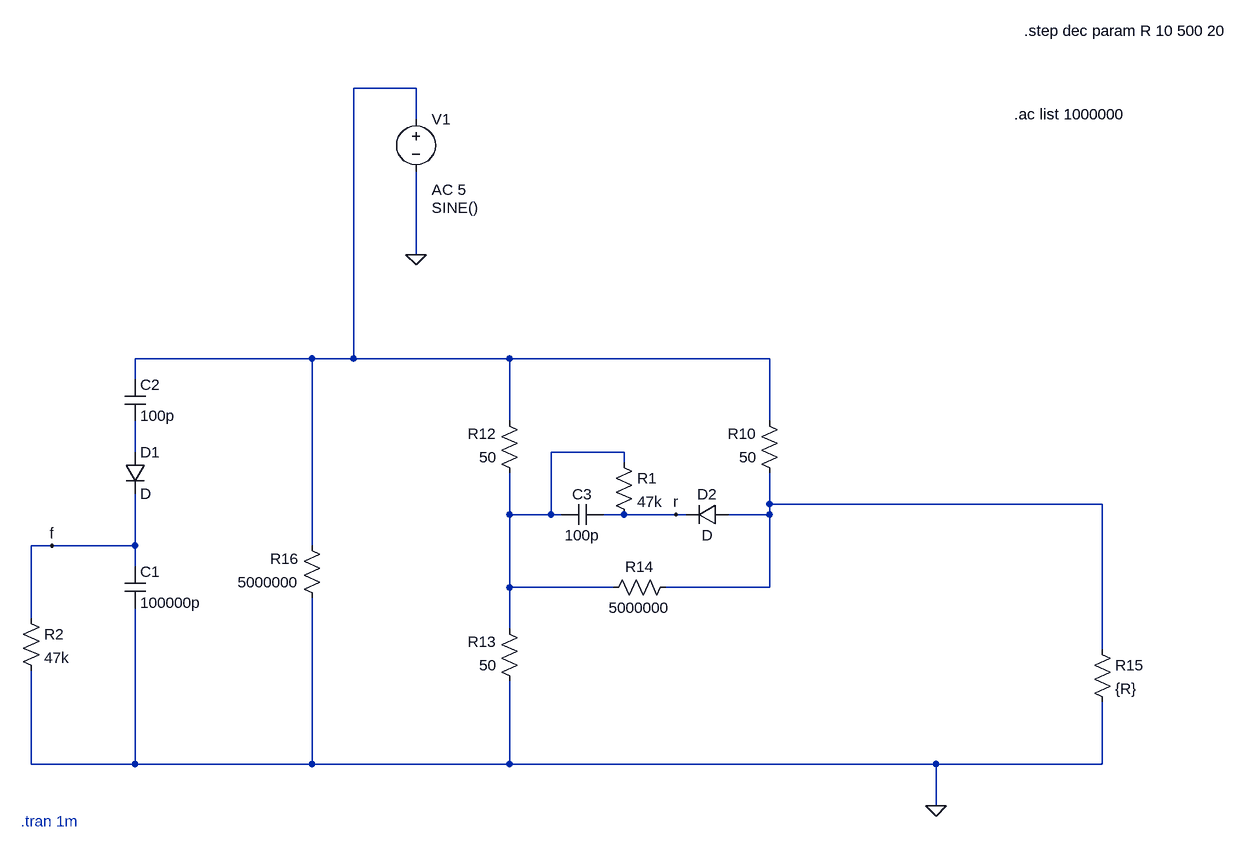
[diagram p0: schematic Mod Gamma Model.asc]
Mod Gamma Model.asc, the LTspice schematic file:
Version 4
SHEET 1 1080 1208
WIRE -192 64 -288 64
WIRE -192 112 -192 64
WIRE -192 320 -192 192
WIRE -352 480 -624 480
WIRE -288 480 -288 64
WIRE -288 480 -352 480
WIRE -48 480 -288 480
WIRE 352 480 -48 480
WIRE -624 512 -624 480
WIRE -48 576 -48 480
WIRE 352 576 352 480
WIRE -624 624 -624 576
WIRE 128 624 16 624
WIRE 128 640 128 624
WIRE 352 704 352 656
WIRE 864 704 352 704
WIRE -48 720 -48 656
WIRE 16 720 16 624
WIRE 16 720 -48 720
WIRE 32 720 16 720
WIRE 128 720 96 720
WIRE 208 720 128 720
WIRE 224 720 208 720
WIRE 352 720 352 704
WIRE 352 720 288 720
WIRE -752 768 -784 768
WIRE -624 768 -624 688
WIRE -624 768 -752 768
WIRE -352 768 -352 480
WIRE -624 800 -624 768
WIRE -48 832 -48 720
WIRE 112 832 -48 832
WIRE 352 832 352 720
WIRE 352 832 192 832
WIRE -784 880 -784 768
WIRE -48 896 -48 832
WIRE 864 928 864 704
WIRE -784 1104 -784 960
WIRE -624 1104 -624 864
WIRE -624 1104 -784 1104
WIRE -352 1104 -352 848
WIRE -352 1104 -624 1104
WIRE -48 1104 -48 976
WIRE -48 1104 -352 1104
WIRE 608 1104 -48 1104
WIRE 864 1104 864 1008
WIRE 864 1104 608 1104
WIRE 608 1168 608 1104
FLAG 608 1168 0
FLAG -192 320 0
FLAG -752 768 f
FLAG 208 720 r
SYMBOL voltage -192 96 R0
WINDOW 123 24 124 Left 2
WINDOW 39 0 0 Left 0
WINDOW 3 24 152 Left 2
SYMATTR Value2 AC 5
SYMATTR InstName V1
SYMATTR Value SINE()
SYMBOL res 368 672 R180
WINDOW 0 36 76 Left 2
WINDOW 3 36 40 Left 2
SYMATTR InstName R10
SYMATTR Value 50
SYMBOL res -32 672 R180
WINDOW 0 36 76 Left 2
WINDOW 3 36 40 Left 2
SYMATTR InstName R12
SYMATTR Value 50
SYMBOL res -32 992 R180
WINDOW 0 36 76 Left 2
WINDOW 3 36 40 Left 2
SYMATTR InstName R13
SYMATTR Value 50
SYMBOL res 208 816 R90
WINDOW 0 0 56 VBottom 2
WINDOW 3 32 56 VTop 2
SYMATTR InstName R14
SYMATTR Value 5000000
SYMBOL res 848 912 R0
SYMATTR InstName R15
SYMATTR Value {R}
SYMBOL res -336 864 R180
WINDOW 0 36 76 Left 2
WINDOW 3 36 40 Left 2
SYMATTR InstName R16
SYMATTR Value 5000000
SYMBOL diode 288 704 R90
WINDOW 0 0 32 VBottom 2
WINDOW 3 32 32 VTop 2
SYMATTR InstName D2
SYMBOL cap 96 704 R90
WINDOW 0 0 32 VBottom 2
WINDOW 3 32 32 VTop 2
SYMATTR InstName C3
SYMATTR Value 100p
SYMBOL res 112 624 R0
SYMATTR InstName R1
SYMATTR Value 47k
SYMBOL diode -640 624 R0
SYMATTR InstName D1
SYMBOL cap -640 800 R0
SYMATTR InstName C1
SYMATTR Value 100000p
SYMBOL res -800 864 R0
SYMATTR InstName R2
SYMATTR Value 47k
SYMBOL cap -640 512 R0
SYMATTR InstName C2
SYMATTR Value 100p
TEXT 744 -24 Left 2 !.step dec param R 10 500 20
TEXT -800 1192 Left 2 ;.tran 1m
TEXT 728 104 Left 2 !.ac list 1000000

The netlist it stands for:
* Mod Gamma Model.asc
V1 N001 0 SINE() AC 5
R10 N004 N001 50
R12 N003 N001 50
R13 0 N003 50
R14 N004 N003 5000000
R15 N004 0 {R}
R16 0 N001 5000000
D2 N004 r D
C3 r N003 100p
R1 N003 r 47k
D1 N002 f D
C1 f 0 100000p
R2 f 0 47k
C2 N001 N002 100p
.model D D
.lib standard.dio
.step dec param R 10 500 20
* .tran 1m
.ac list 1000000
.backanno
.end